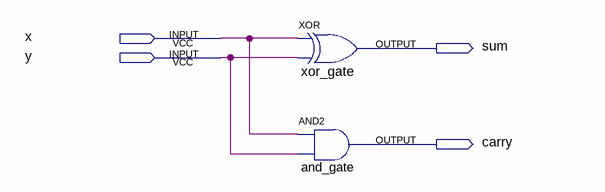
[diagram p0: schematic sheet]
// Quartus schematic full_adder.bdf as structural Verilog: 2 symbols, 4 pins
module full_adder (
  input  x,
  input  y,
  output sum,
  output carry
);

  xor xor_gate (sum, x, y);
  and and_gate (carry, x, y);
endmodule
